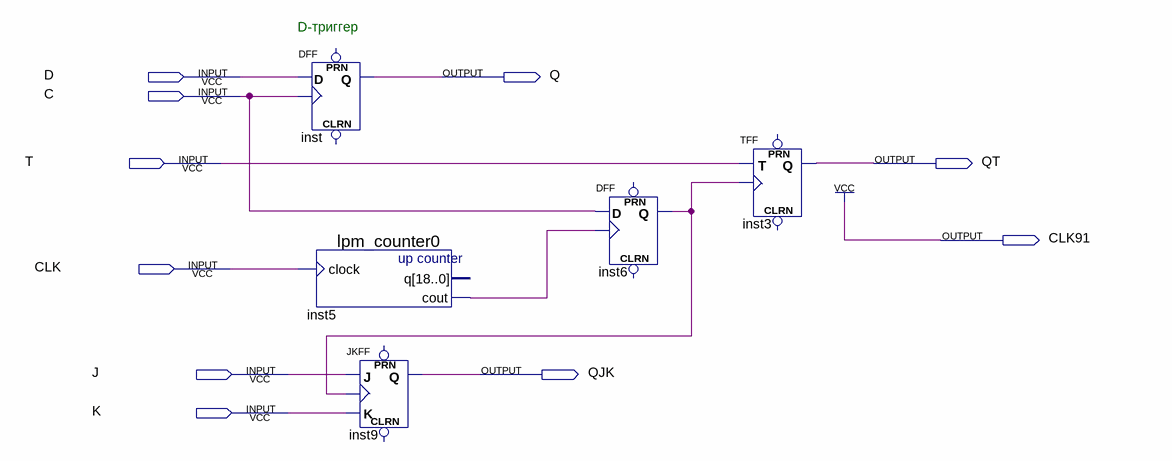
[diagram p0: schematic sheet]
// Quartus schematic D_T_JK-triggers.bdf as structural Verilog: 5 symbols, 10 pins
module \D_T_JK-triggers  (
  input  D,
  input  C,
  input  T,
  input  CLK,
  input  J,
  input  K,
  output Q,
  output QT,
  output CLK91,
  output QJK
);

  wire inst5_cout, inst6_q;

  DFF inst (.CLK(C), .D(D), .Q(Q));  // open: CLRN, PRN
  lpm_counter0 inst5 (.clock(CLK), .cout(inst5_cout));  // open: q
  JKFF inst9 (.K(K), .J(J), .CLK(inst6_q), .Q(QJK));  // open: PRN, CLRN
  DFF inst6 (.CLK(inst5_cout), .D(C), .Q(inst6_q));  // open: CLRN, PRN
  TFF inst3 (.T(T), .CLK(inst6_q), .Q(QT));  // open: PRN, CLRN

  assign CLK91 = 1'b1;

  // Notes on the sheet:
  //   D-триггер
endmodule
